# EAGLE design SkateboardIntegrated (EAGLE 9.6.2)
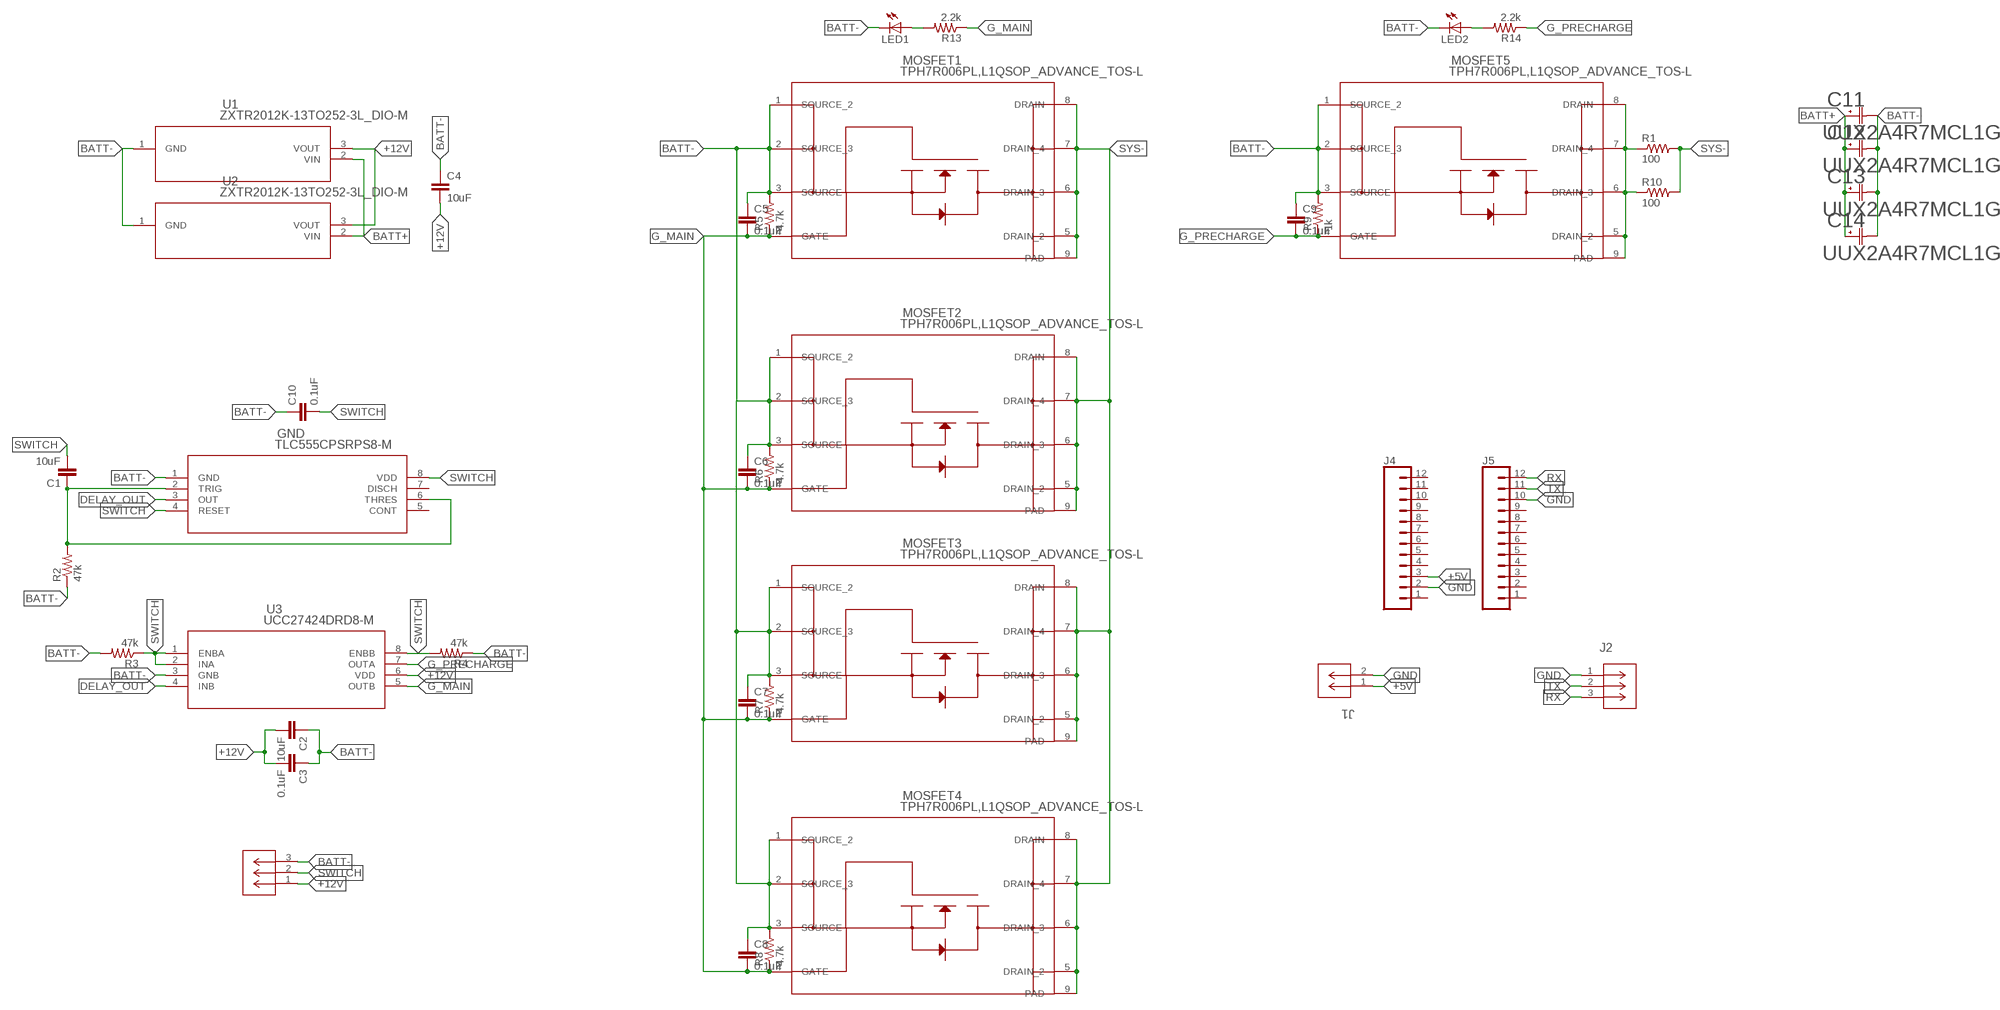
[diagram p0: schematic, sheet 1]

## Parts
C1  10uF  10UF-0805-10V-10%  [0805]
C2  10uF  10UF-0805-10V-10%  [0805]
C3  0.1uF  10UF-0805-10V-10%  [0805]
C4  10uF  10UF-0805-10V-10%  [0805]
C5  0.1uF  10UF-0805-10V-10%  [0805]
C6  0.1uF  10UF-0805-10V-10%  [0805]
C7  0.1uF  10UF-0805-10V-10%  [0805]
C8  0.1uF  10UF-0805-10V-10%  [0805]
C9  0.1uF  10UF-0805-10V-10%  [0805]
C10  0.1uF  10UF-0805-10V-10%  [0805]
C11  UUX2A4R7MCL1GS  [CAP_UCD_8X6P2_NCH]
C12  UUX2A4R7MCL1GS  [CAP_UCD_8X6P2_NCH]
C13  UUX2A4R7MCL1GS  [CAP_UCD_8X6P2_NCH]
C14  UUX2A4R7MCL1GS  [CAP_UCD_8X6P2_NCH]
GND  TLC555CPSRPS8-M  [PS8-M]
J1  1775470-2  [CONN2_1775470-2_TEC]
J2  1775470-3  [CONN3_1775470-3_TEC]
J3  1775470-3  [CONN3_1775470-3_TEC]
J4  CONN_12SMD_ALT  [1X12_SMD_ALT]
J5  CONN_12SMD_ALT  [1X12_SMD_ALT]
LED1  LEDCHIPLED_0805  [CHIPLED_0805]
LED2  LEDCHIPLED_0805  [CHIPLED_0805]
MOSFET1  TPH7R006PL,L1QSOP_ADVANCE_TOS-L  [SOP_ADVANCE_TOS-L]
MOSFET2  TPH7R006PL,L1QSOP_ADVANCE_TOS-L  [SOP_ADVANCE_TOS-L]
MOSFET3  TPH7R006PL,L1QSOP_ADVANCE_TOS-L  [SOP_ADVANCE_TOS-L]
MOSFET4  TPH7R006PL,L1QSOP_ADVANCE_TOS-L  [SOP_ADVANCE_TOS-L]
MOSFET5  TPH7R006PL,L1QSOP_ADVANCE_TOS-L  [SOP_ADVANCE_TOS-L]
R1  100  R-US_R2512  [R2512]
R2  47k  R-US_R0805  [R0805]
R3  47k  R-US_R0805  [R0805]
R4  47k  R-US_R0805  [R0805]
R5  4.7k  R-US_R0805  [R0805]
R6  4.7k  R-US_R0805  [R0805]
R7  4.7k  R-US_R0805  [R0805]
R8  4.7k  R-US_R0805  [R0805]
R9  1k  R-US_R0805  [R0805]
R10  100  R-US_R2512  [R2512]
R13  2.2k  R-US_R0805  [R0805]
R14  2.2k  R-US_R0805  [R0805]
U1  ZXTR2012K-13TO252-3L_DIO-M  [TO252-3L_DIO-M]
U2  ZXTR2012K-13TO252-3L_DIO-M  [TO252-3L_DIO-M]
U3  UCC27424DRD8-M  [D8-M]

## Nets
+5V: J1.1 J4.3
+12V: C2.2 C3.2 C4.2 J3.1 U1.3(VOUT) U2.3(VOUT) U3.6(VDD)
BATT+: C11.1 C12.1 C13.1 C14.1 U1.2(VIN) U2.2(VIN)
BATT-: C2.1 C3.1 C4.1 C5.1 C6.1 C7.1 C8.1 C9.1 C10.1 C11.2 C12.2 C13.2 C14.2 GND.1(GND) J3.3 LED1.C LED2.C MOSFET1.1(SOURCE_2) MOSFET1.2(SOURCE_3) MOSFET1.3(SOURCE) MOSFET2.1(SOURCE_2) MOSFET2.2(SOURCE_3) MOSFET2.3(SOURCE) MOSFET3.1(SOURCE_2) MOSFET3.2(SOURCE_3) MOSFET3.3(SOURCE) MOSFET4.1(SOURCE_2) MOSFET4.2(SOURCE_3) MOSFET4.3(SOURCE) MOSFET5.1(SOURCE_2) MOSFET5.2(SOURCE_3) MOSFET5.3(SOURCE) R2.1 R3.2 R4.1 R5.2 R6.2 R7.2 R8.2 R9.2 U1.1(GND) U2.1(GND) U3.3(GNB)
DELAY_OUT: GND.3(OUT) U3.4(INB)
G_MAIN: C5.2 C6.2 C7.2 C8.2 MOSFET1.4(GATE) MOSFET2.4(GATE) MOSFET3.4(GATE) MOSFET4.4(GATE) R5.1 R6.1 R7.1 R8.1 R13.1 U3.5(OUTB)
G_PRECHARGE: C9.2 MOSFET5.4(GATE) R9.1 R14.1 U3.7(OUTA)
GND: J1.2 J2.1 J4.2 J5.10
N$2: C1.1 GND.2(TRIG) GND.6(THRES) R2.2
N$3: MOSFET5.5(DRAIN_2) MOSFET5.6(DRAIN_3) MOSFET5.7(DRAIN_4) MOSFET5.8(DRAIN) MOSFET5.9(PAD) R1.1 R10.1
N$4: LED1.A R13.2
N$6: LED2.A R14.2
RX: J2.3 J5.12
SWITCH: C1.2 C10.2 GND.4(RESET) GND.8(VDD) J3.2 R3.1 R4.2 U3.1(ENBA) U3.2(INA) U3.8(ENBB)
SYS-: MOSFET1.5(DRAIN_2) MOSFET1.6(DRAIN_3) MOSFET1.7(DRAIN_4) MOSFET1.8(DRAIN) MOSFET1.9(PAD) MOSFET2.5(DRAIN_2) MOSFET2.6(DRAIN_3) MOSFET2.7(DRAIN_4) MOSFET2.8(DRAIN) MOSFET2.9(PAD) MOSFET3.5(DRAIN_2) MOSFET3.6(DRAIN_3) MOSFET3.7(DRAIN_4) MOSFET3.8(DRAIN) MOSFET3.9(PAD) MOSFET4.5(DRAIN_2) MOSFET4.6(DRAIN_3) MOSFET4.7(DRAIN_4) MOSFET4.8(DRAIN) MOSFET4.9(PAD) R1.2 R10.2
TX: J2.2 J5.11
Unconnected: GND.5(CONT) GND.7(DISCH) J4.1 J4.4 J4.5 J4.6 J4.7 J4.8 J4.9 J4.10 J4.11 J4.12 J5.1 J5.2 J5.3 J5.4 J5.5 J5.6 J5.7 J5.8 J5.9

## Library data of the parts
C1 C2 C4 = SparkFun-Capacitors:10UF: 10.0µF ceramic capacitors A capacitor is a passive two-terminal electrical component used to store electrical energy temporarily in an electric field.; PROD_ID: CAP-11330
C3 C5-C10 = SparkFun-Capacitors:10UF: 10.0µF ceramic capacitors A capacitor is a passive two-terminal electrical component used to store electrical energy temporarily in an electric field.; PROD_ID: CAP-11330; VALUE: 10uF
C11-C14 = SkateboardLib:UUX2A4R7MCL1GS; COPYRIGHT: Copyright (C) 2022 Ultra Librarian. All rights reserved.; DIGI-KEY_PART_NUMBER_1: 493-6282-1-ND; DIGI-KEY_PART_NUMBER_2: 493-6282-2-ND; DIGI-KEY_PART_NUMBER_3: 493-6282-6-ND; MANUFACTURER_PART_NUMBER: UUX2A4R7MCL1GS; MFR_NAME: Nichicon
GND = SkateboardLib:TLC555CPSR; COPYRIGHT: Copyright (C) 2022 Ultra Librarian. All rights reserved.; DIGI-KEY_PART_NUMBER_1: 296-15028-1-ND; DIGI-KEY_PART_NUMBER_2: 296-15028-2-ND; DIGI-KEY_PART_NUMBER_3: 296-15028-6-ND; DIGI-KEY_PART_NUMBER_4: 2156-TLC555CPSR-ND; MANUFACTURER_PART_NUMBER: TLC555CPSR; MFR_NAME: Texas Instruments
J1 = SkateboardLib:1775470-2; COPYRIGHT: Copyright (C) 2022 Ultra Librarian. All rights reserved.; DIGI-KEY_PART_NUMBER_1: A100052CT-ND; DIGI-KEY_PART_NUMBER_2: A100052DKR-ND; DIGI-KEY_PART_NUMBER_3: A100052TR-ND; MANUFACTURER_PART_NUMBER: 1775470-2; MFR_NAME: TE Connectivity
J2 J3 = SkateboardLib:1775470-3; COPYRIGHT: Copyright (C) 2022 Ultra Librarian. All rights reserved.; DIGI-KEY_PART_NUMBER_1: A100053CT-ND; DIGI-KEY_PART_NUMBER_2: A100053DKR-ND; DIGI-KEY_PART_NUMBER_3: A100053TR-ND; MANUFACTURER_PART_NUMBER: 1775470-3; MFR_NAME: TE Connectivity
J4 J5 = SparkFun-Connectors:CONN_12: Multi connection point. Often used as Generic Header-pin footprint for 0.1 inch spaced/style header connections On any of the 0.1 inch spaced packages, you can populate with these: Break Away Headers - Straight <https://www.sparkfun.com/products/116> (PRT-00116) Break Away Male Headers - Right Angle <https://www.sparkfun.com/products/553> (PRT-00553) Female Headers <https://www.sparkfun.com/products/115> (PRT-00115) Break Away Headers - Machine Pin <https://www.sparkfun.com/products/117> (PRT-00117) Break Away Female Headers - Swiss Machine Pin <https://www.sparkfun.com/products/743> (PRT-00743) For SCREWTERMINALS and SPRING TERMINALS visit here: Screw Terimnals on SparkFun.com <https://www.sparkfun.com/search/results?term=Screw+Terminals> (5mm/3.5mm/2.54mm spacing) This device is also useful as a general connection point to wire up your design to another part of your project. Our various solder wires solder well into these plated through hole pads. Hook-Up Wire - Assortment (Stranded, 22 AWG) <https://www.sparkfun.com/products/11375> (PRT-11375) Hook-Up Wire - Assortment (Solid Core, 22 AWG) <https://www.sparkfun.com/products/11367> (PRT-11367) View the entire wire category on our website here <https://www.sparkfun.com/categories/141> Special notes: Molex polarized connector foot print use with SKU : PRT-08231 with associated crimp pins and housings. 1MM SMD Version SKU: PRT-10208 NOTES ON THE VARIANTS LOCK and LOCK_LONGPADS... This footprint was designed to help hold the alignment of a through-hole component (i.e. 6-pin header) while soldering it into place. You may notice that each hole has been shifted either up or down by 0.005 of an inch from it's more standard position (which is a perfectly straight line). This slight alteration caused the pins (the squares in the middle) to touch the edges of the holes. Because they are alternating, it causes a "brace" to hold the component in place. 0.005 has proven to be the perfect amount of "off-center" position when using our standard breakaway headers. Although looks a little odd when you look at the bare footprint, once you have a header in there, the alteration is very hard to notice. Also,if you push a header all the way into place, it is covered up entirely on the bottom side.; PROD_ID: CONN-15197
LED1 LED2 = adafruit:LED: LED OSRAM: - CHIPLED LG R971, LG N971, LY N971, LG Q971, LY Q971, LO R971, LY R971 LH N974, LH R974 LS Q976, LO Q976, LY Q976 LO Q996 - Hyper CHIPLED LW Q18S LB Q993, LB Q99A, LB R99A - SideLED LS A670, LO A670, LY A670, LG A670, LP A670 LB A673, LV A673, LT A673, LW A673 LH A674 LY A675 LS A676, LA A676, LO A676, LY A676, LW A676 LS A679, LY A679, LG A679 - Hyper Micro SIDELED® LS Y876, LA Y876, LO Y876, LY Y876 LT Y87S - SmartLED LW L88C, LW L88S LB L89C, LB L89S, LG L890 LS L89K, LO L89K, LY L89K LS L896, LA L896, LO L896, LY L896 - TOPLED LS T670, LO T670, LY T670, LG T670, LP T670 LSG T670, LSP T670, LSY T670, LOP T670, LYG T670 LG T671, LOG T671, LSG T671 LB T673, LV T673, LT T673, LW T673 LH T674 LS T676, LA T676, LO T676, LY T676, LB T676, LH T676, LSB T676, LW T676 LB T67C, LV T67C, LT T67C, LS T67K, LO T67K, LY T67K, LW E67C LS E67B, LA E67B, LO E67B, LY E67B, LB E67C, LV E67C, LT E67C LW T67C LS T679, LY T679, LG T679 LS T770, LO T770, LY T770, LG T770, LP T770 LB T773, LV T773, LT T773, LW T773 LH T774 LS E675, LA E675, LY E675, LS T675 LS T776, LA T776, LO T776, LY T776, LB T776 LHGB T686 LT T68C, LB T68C - Hyper Mini TOPLED® LB M676 - Mini TOPLED Santana® LG M470 LS M47K, LO M47K, LY M47K Source: http://www.osram.convergy.de/
MOSFET1-MOSFET5 = SkateboardLib:TPH7R006PL,L1Q; COPYRIGHT: Copyright (C) 2022 Ultra Librarian. All rights reserved.; DIGI-KEY_PART_NUMBER_1: TPH7R006PLL1QTR-ND; DIGI-KEY_PART_NUMBER_2: TPH7R006PLL1QCT-ND; DIGI-KEY_PART_NUMBER_3: TPH7R006PLL1QDKR-ND; MANUFACTURER_PART_NUMBER: TPH7R006PL,L1Q; MFR_NAME: Toshiba Electronic Devices & Storage Co.
R1-R10 R13 R14 = adafruit:R-US_: RESISTOR, American symbol
U1 U2 = SkateboardLib:ZXTR2012K-13; COPYRIGHT: Copyright (C) 2022 Ultra Librarian. All rights reserved.; DIGI-KEY_PART_NUMBER_1: ZXTR2012K-13DICT-ND; DIGI-KEY_PART_NUMBER_2: ZXTR2012K-13DIDKR-ND; DIGI-KEY_PART_NUMBER_3: ZXTR2012K-13DITR-ND; MANUFACTURER_PART_NUMBER: ZXTR2012K-13; MFR_NAME: Diodes Inc
U3 = SkateboardLib:UCC27424DR; COPYRIGHT: Copyright (C) 2022 Ultra Librarian. All rights reserved.; DIGI-KEY_PART_NUMBER_1: 2156-UCC27424DR-ND; DIGI-KEY_PART_NUMBER_2: 2156-UCC27424DR-TI-ND; DIGI-KEY_PART_NUMBER_3: 296-39526-1-ND; DIGI-KEY_PART_NUMBER_4: 296-39526-2-ND; DIGI-KEY_PART_NUMBER_5: 296-39526-6-ND; DIGI-KEY_PART_NUMBER_6: UCC27424DR-ND; MANUFACTURER_PART_NUMBER: UCC27424DR; MFR_NAME: Texas Instruments

## Board
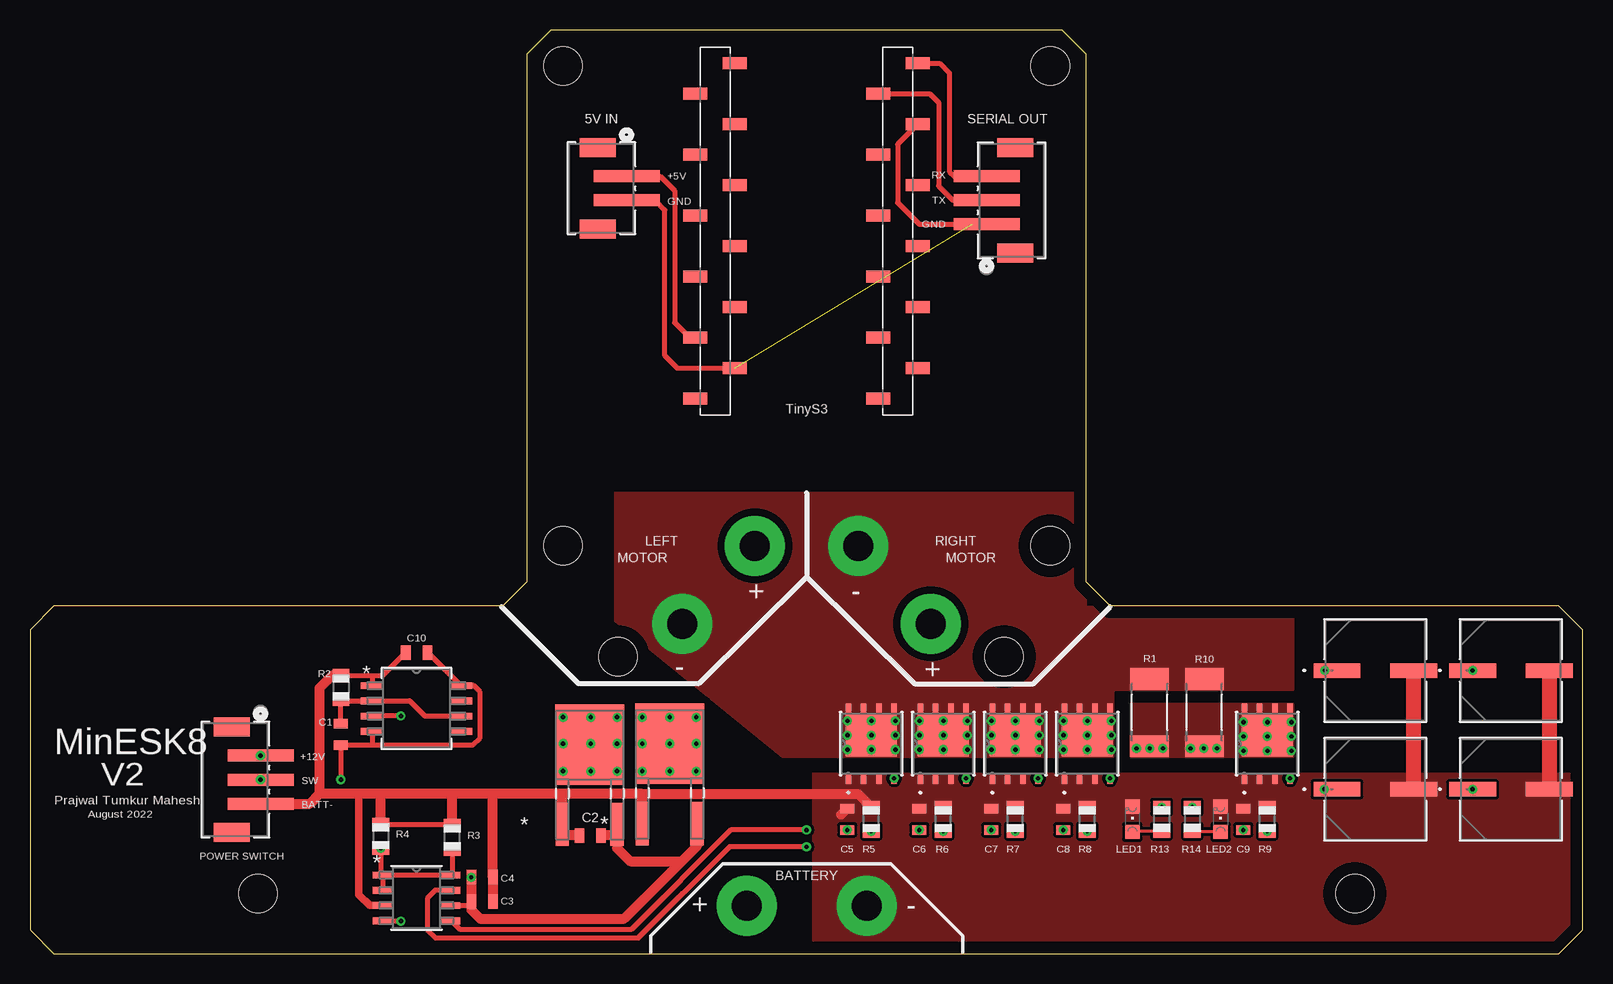
[diagram p1: board, top side]
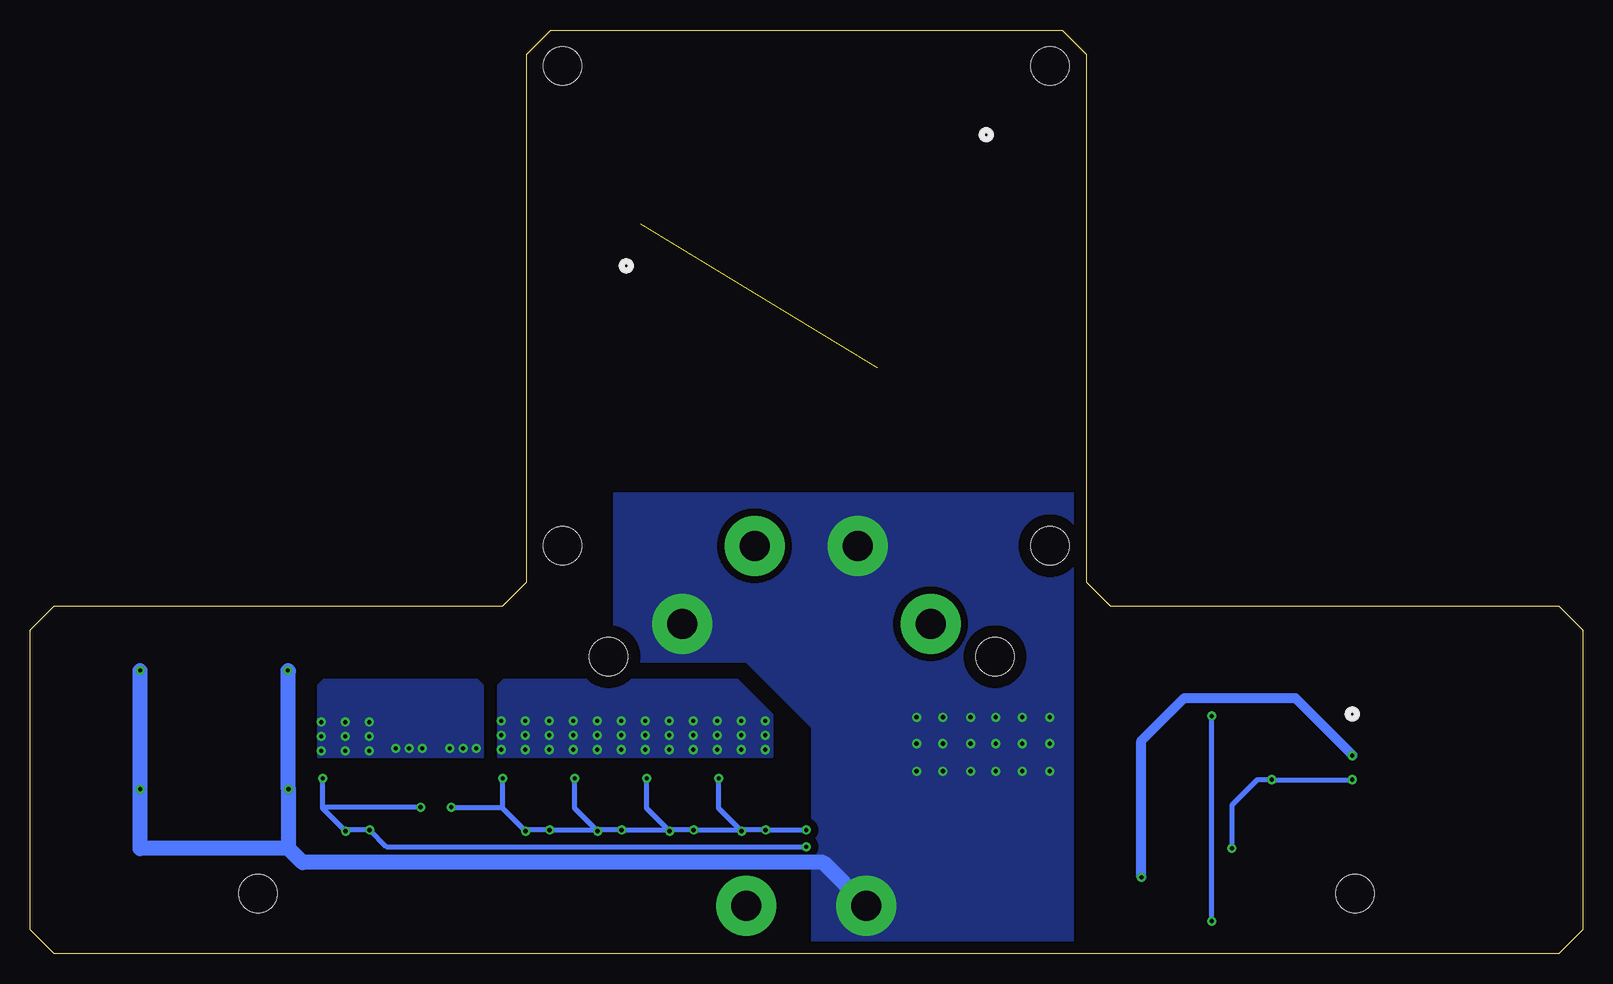
[diagram p2: board, bottom side, seen from below]

Size 129.4 x 77 mm. Coordinates in mm from the lower left corner, seen from the top.
Outline: 41.4,75 41.4,31 39.4,29 2,29 0,27 0,2 2,0 127.4,0 129.4,2 129.4,27 127.4,29 90.02,29 88.02,31 88.02,75 86.02,77 43.4,77 41.4,75
Copper layers (1*16): Top 0.035mm / dielectric 1.5mm / Bottom 0.035mm
Design rules "default *": minimum track width 6mil, minimum drill 0.35mm, track to track 6mil, track to pad 6mil, pad to pad 6mil, via to via 6mil, smd to smd 6mil, copper to edge 40mil, drill to drill 6mil, minimum pad ring 10mil, minimum via ring 8mil, stop-mask expansion 4mil, vias tented up to drill 0.35mm, thermal gap 10mil
Holes 3.2 mm at 44.4,74 85.02,74 44.4,34 19,5 110.4,5 81.18,24.76 48.99,24.76 85.02,34

### Footprints (pad centres in the part's own frame; a part is rotated, then mirrored left to right if it is on the bottom)
0805 = smd 0.8 x 1.2: 1 -0.9,0; 2 0.9,0
CAP_UCD_8X6P2_NCH = smd 3.905 x 1.213: 1 -3.196,0; 2 3.196,0
PS8-M = smd 1.94 x 0.558: 1 -3.682,1.905; 2 -3.682,0.635; 3 -3.682,-0.635; 4 -3.682,-1.905; 5 3.682,-1.905; 6 3.682,-0.635; 7 3.682,0.635; 8 3.682,1.905
CONN2_1775470-2_TEC = smd 1 x 5.5: 1 -2,0; 2 0,0 | smd 1.6 x 3: 3 -4.4,-2.4; 4 2.4,-2.4
CONN3_1775470-3_TEC = smd 1 x 5.5: 1 -4,0; 2 -2,0; 3 0,0 | smd 1.6 x 3: 4 -6.4,-2.4; 5 2.4,-2.4
1X12_SMD_ALT = smd 1 x 2: 1 -1.27,-1.65; 2 -3.81,1.65; 3 -6.35,-1.65; 4 -8.89,1.65; 5 -11.43,-1.65; 6 -13.97,1.65; 7 -16.51,-1.65; 8 -19.05,1.65; 9 -21.59,-1.65; 10 -24.13,1.65; 11 -26.67,-1.65; 12 -29.21,1.65
CHIPLED_0805 = smd 1.2 x 1.2: A 0,-1.05; C 0,1.05
SOP_ADVANCE_TOS-L = smd 0.911 x 0.458: 1 -2.894,1.905; 2 -2.894,0.635; 3 -2.894,-0.635; 4 -2.894,-1.905; 5 2.894,-1.905; 6 2.894,-0.635; 7 2.894,0.635; 8 2.894,1.905 | smd 3.5 x 4.25: 9 0.7,0
R2512 = smd 1.8 x 3.2: 1 -2.8,0; 2 2.8,0
R0805 = smd 1.1 x 1.4: 1 -1,0; 2 1,0
TO252-3L_DIO-M = smd 1.117 x 3.591: 1 -2.286,-6.603; 3 2.286,-6.603 | smd 5.74 x 6.706: 2 0,0.051
D8-M = smd 1.655 x 0.558: 1 -2.821,1.905; 2 -2.821,0.635; 3 -2.821,-0.635; 4 -2.821,-1.905; 5 2.821,-1.905; 6 2.821,-0.635; 7 2.821,0.635; 8 2.821,1.905

### Placement (x,y rotation side)
C1  25.9,18.28 270 top
C2  46.7,9.84 0 top
C3  37.68,4.35 180 top
C4  37.68,6.36 180 top
C5  68.1,11.2 270 top
C6  74.1,11.2 270 top
C7  80.1,11.2 270 top
C8  86.1,11.2 270 top
C9  101.1,11.2 270 top
C10  32.21,25.1 0 top
C11  112.11,23.6 0 top
C12  123.41,23.6 0 top
C13  112.11,13.7 0 top
C14  123.41,13.7 0 top
GND  32.21,20.43 0 top
J1  49.71,62.8 270 top
J2  79.71,64.8 90 top
J3  19.21,12.5 270 top
J4  57.09,45 270 top
J5  72.33,45 270 top
LED1  91.87,11.2 0 top
LED2  99.22,11.2 0 top
MOSFET1  70.1,17.5 90 top
MOSFET2  76.1,17.5 90 top
MOSFET3  82.1,17.5 90 top
MOSFET4  88.1,17.5 90 top
MOSFET5  103.1,17.5 90 top
R1  93.3,20.1 90 top
R2  25.91,22.18 270 top
R3  35.19,9.68 90 top
R4  29.24,9.78 270 top
R5  70.1,11.2 90 top
R6  76.1,11.2 90 top
R7  82.1,11.2 90 top
R8  88.1,11.2 90 top
R9  103.1,11.2 90 top
R10  97.86,20.1 90 top
R13  94.3,11.2 270 top
R14  96.85,11.2 270 top
U1  46.64,17.38 0 top
U2  53.31,17.44 0 top
U3  32.21,4.64 0 top

### Tracks (layer width: path | path; a pad name or v marks a point on that pad's centre or on a via)
+5V
  Top 0.406: J1.1 52.51,64.8 53.71,63.6 53.71,52.6 54.96,51.35 J4.3
+12V  (via drill 0.35)
  Top 0.254: 48.93,10.68 48.93,10.7
  Top 0.406: U3.6 36.78,4 C3.2
  Top 0.813: 54.31,7.7 50.01,7.7 48.93,8.78 48.93,9.88 | U2.3 55.6,8.99 54.31,7.7 | 54.31,7.7 49.51,2.9 37.51,2.9 36.78,3.63 C3.2 C4.2 | 48.93,9.88 48.89,9.84 C2.2 | 48.93,9.88 48.93,10.68 U1.3
  Bottom 0.813: C4.2 36.78,17.73 33.21,21.3 23.96,21.3 19.21,16.55 J3.1
  other vias: 36.78,6.36 19.21,16.5
BATT+  (via drill 0.35, 2.5 pad 5)
  Top 0.813: C11.1 v107.91,23.6 | C13.1 v107.86,13.7 | U2.2 v53.32,17.5 | U1.2 46.71,17.5 v46.72,17.5
  Bottom 1.27: v59.71,4 63.31,7.6 106.71,7.6 107.86,8.75 | v107.91,23.6 107.86,23.55 v107.86,13.7 107.86,8.75 | C12.1 C14.1 120.21,8.75 107.86,8.75
  other vias: 75.06,27.5 60.41,34 55.52,19.7 53.32,19.7 51.02,19.7 55.52,17.5 51.02,17.5 55.52,15.2 53.32,15.2 51.02,15.2 48.92,19.7 46.72,19.7 44.42,19.7 48.92,17.5 44.42,17.5 48.92,15.2 46.72,15.2 44.42,15.2 120.21,13.7 120.21,23.6
  pour Bottom (isolate 0.61): 42.5,38.4 42.5,0 64.21,0 64.21,18.8 69.72,24.3 80.71,24.28 80.71,38.4
BATT-  (via drill 2.5 pad 5)
  Top 0.254: GND.1 28.74,22.34
  Top 0.406: R4.1 35.09,10.78 R3.2 | 31.29,25.1 C10.1 29.39,23.18 28.51,23.18 | R2.1 28.51,23.18 | 28.51,23.18 28.53,23.16 GND.1
  Top 0.61: U3.3 28.3,4 27.41,4.9 27.41,13.3
  Top 0.813: C5.1 67.6,11.6 | R2.1 25.18,23.18 24.11,22.11 24.11,13.3 | 35.23,10.78 35.33,10.68 R3.2 35.19,13.28 35.21,13.3 | 51.01,13.3 44.21,13.3 | C2.1 44.35,9.84 U1.1 44.35,13.16 44.21,13.3 | 51.01,13.3 69,13.3 R5.2 | 44.21,13.3 38.61,13.3 | 38.61,13.3 35.21,13.3 | 35.21,13.3 29.11,13.3 | 29.11,13.3 27.41,13.3 24.11,13.3 | R4.1 29.24,13.17 29.11,13.3 | 38.61,13.3 38.58,13.27 C4.1 C3.1 | U2.1 51.02,13.29 51.01,13.3 | J3.3 23.31,12.5 24.11,13.3
  Top 1.27: C13.2 C11.2 | C12.2 C14.2
  other vias: 69.71,4
  pour Top (isolate 0.254, no thermals): 129.4,15 65.21,15 65.21,0 129.4,0.1
DELAY_OUT  (via drill 0.35)
  Top 0.406: U3.4 30.87,2.73 v30.91,2.7 | v30.91,19.8 v30.9,19.8 GND.3
  Bottom 0.406: v30.91,2.7 v30.91,19.8
G_MAIN  (via drill 0.35)
  Top 0.406: U3.5 35.12,2.73 35.86,2 50.1,2 58.4,10.3 v64.71,10.3
  Bottom 0.254: 90,12.11 90,12.2
  Bottom 0.406: MOSFET1.4 72,12.11 R5.1 70,10.3 | R6.1 78,12.11 MOSFET2.4 | MOSFET3.4 84,12.11 R7.1 82,10.3 | 90,12.11 R8.1 88,10.3 C8.2 82,10.3 | 90,12.11 MOSFET4.4 | 70,10.3 C5.2 v64.71,10.3 | R6.1 76,10.3 C6.2 70,10.3 | 82,10.3 C7.2 76.2,10.3 R6.1 | R13.1 90.1,12.2 90,12.11
  other vias: 70.1,10.2 72,14.61 76.1,10.2 78,14.61 82.1,10.2 84,14.61 88.1,10.2 90,14.61 94.3,12.2 68.1,10.3 74.1,10.3 80.1,10.3 86.1,10.3
G_PRECHARGE  (via drill 0.35)
  Top 0.406: v64.71,8.9 58.3,8.9 50.7,1.3 33.81,1.3 33.11,2 33.11,4.6 33.78,5.28 U3.7
  Bottom 0.406: 105,12.11 R9.1 103,10.3 C9.2 99.7,8.9 v64.71,8.9 | 105,12.11 MOSFET5.4 | R14.1 104.91,12.2 105,12.11
  other vias: 103.1,10.2 105,14.61 96.85,12.2 101.1,10.3
GND  (1 unrouted)
  Top 0.406: J1.2 52.11,62.8 52.91,62 52.91,49.84 53.94,48.81 J4.2 | J5.10 72.31,67.46 72.31,62.6 74.11,60.8 79.51,60.8
  Top 1.016: 78.51,60.8 79.51,60.8 J2.1
N$2
  Top 0.254: C1.1
  Top 0.406: C1.1 R2.2 26.02,21.07 GND.2 31.64,21.07 32.91,19.8 GND.6
N$3  (via drill 0.35)
  other vias: 105.12,19.3 105.12,18.1 101.12,19.3 105.12,16.9 103.12,18.1 101.12,18.1 103.12,16.9 101.12,16.9 103.12,19.3 92.21,17.1 93.31,17.1 94.41,17.1 96.71,17.1 97.81,17.1 98.91,17.1
  pour Top (no thermals): 91.7,16.4 105.3,16.4 105.3,20.8 91.7,20.8
  pour Bottom: 105.41,16.4 91.61,16.4 91.61,22.3 92.11,22.8 104.91,22.8 105.41,22.3
N$4
  Top 0.254: R13.2 91.92,10.2 LED1.A
N$6
  Top 0.254: R14.2 99.17,10.2 LED2.A
RX
  Top 0.406: J2.3 77.01,64.8 76.61,65.2 76.61,73.4 75.8,74.21 J5.12
  Top 1.016: 79.81,64.8 J2.3
SWITCH  (via drill 0.35)
  Top 0.254: C10.2 33.34,25.1
  Top 0.406: R3.1 35.19,6.71 | 35.19,6.71 U3.8 | U3.1 29.24,6.68 R4.2 | C10.2 33.13,25.1 GND.8 36.97,22.34 37.51,21.8 37.51,18 36.89,17.38 28.51,17.38 | 28.51,17.38 C1.2 v25.9,14.51 v25.91,14.5 | GND.4 28.53,17.4 28.51,17.38 | U3.1 U3.2 | U3.1 U3.8 35.19,6.71
  Bottom 0.406: R4.2 29.24,12.37 27.11,14.5 v25.91,14.5 J3.2
  other vias: 29.24,8.78 19.21,14.5
SYS-  (via drill 0.35, 2.5 pad 5)
  other vias: 54.35,27.5 69.01,34 72.12,19.4 72.12,18.2 68.12,19.4 72.12,17 70.12,18.2 68.12,18.2 70.12,17 68.12,17 70.12,19.4 78.12,19.4 78.12,18.2 74.12,19.4 78.12,17 76.12,18.2 74.12,18.2 76.12,17 74.12,17 76.12,19.4 84.12,19.4 84.12,18.2 80.12,19.4 84.12,17 82.12,18.2 80.12,18.2 82.12,17 80.12,17 82.12,19.4 90.12,19.4 90.12,18.2 86.12,19.4 90.12,17 88.12,18.2 86.12,18.2 88.12,17 86.12,17 88.12,19.4
  pour Top (isolate 0.61, no thermals): 48.71,38.4 48.71,27.76 62.74,16.4 90.3,16.4 90.3,22 105.3,22 105.3,28.9 88.02,28.9 88.02,38.4
  pour Bottom: 67.51,16.4 67.51,19.9 70.41,22.8 89.91,22.8 90.41,22.3 90.41,16.4
TX
  Top 0.406: J2.2 76.91,62.8 75.71,64 75.71,70.94 74.98,71.67 J5.11
  Top 1.016: 79.11,62.8 J2.2

### Text on the board
tPlace: 5V IN | SERIAL OUT | RX | +5V | TX | GND | GND | LEFT | RIGHT | MOTOR | MOTOR | + | - | - | + | POWER SWITCH | BATTERY | + | -
tNames: TinyS3 | MinESK8 | +12V | V2 | SW | Prajwal Tumkur Mahesh | BATT- | August 2022